# Altium schematic sheet UTHP CAN Connections.SchDoc: Ultimate Truck Hacking Platform
size Letter; Author: Dr. Jeremy Daily; Organization: Systems Cyber Research Group; Address2: Thomas Balzer; Address3: Carson Green; DocumentNumber: Controller Area Networks; Revision: 1; SheetNumber: 2; SheetTotal: 6
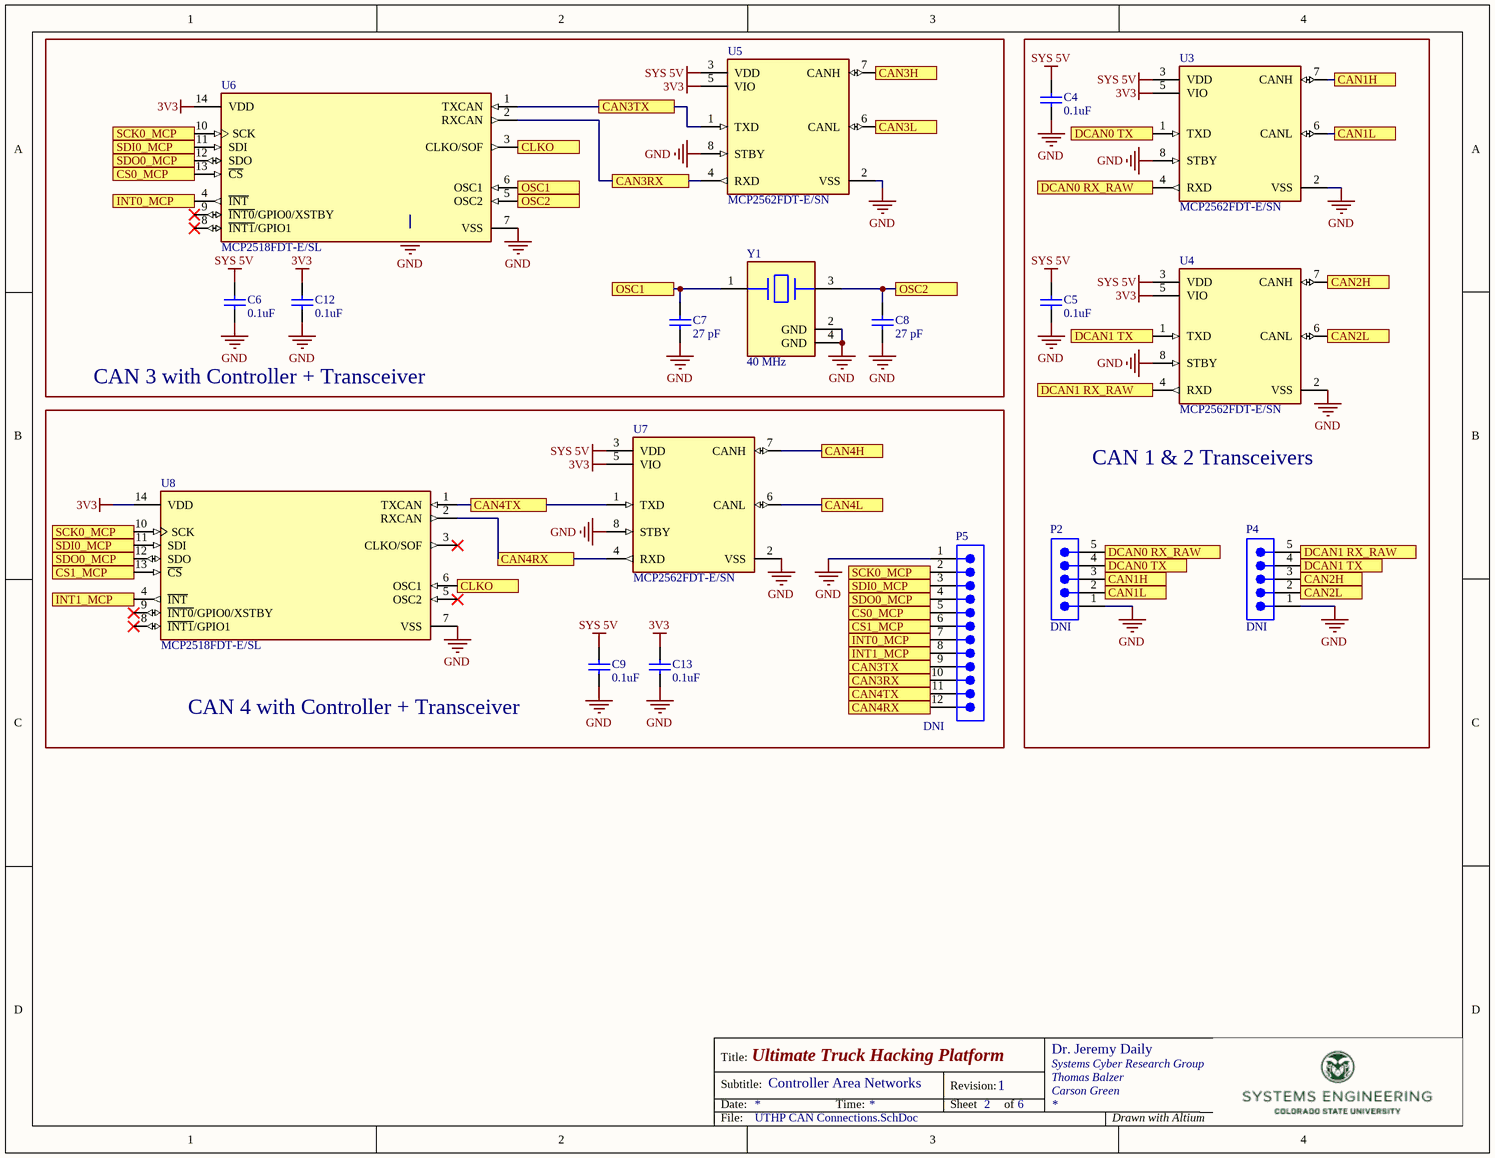
[diagram p0: UTHP CAN Connections.SchDoc]

## Parts
C4  0.1uF  [CAPC1608X90X35LL15T15]
C5  0.1uF  [CAPC1608X90X35LL15T15]
C6  0.1uF  [CAPC1608X90X35LL15T15]
C7  27 pF  [CAPC1005X55X25LL05T10]
C8  27 pF  [CAPC1005X55X25LL05T10]
C9  0.1uF  [CAPC1608X90X35LL15T15]
C12  0.1uF  [CAPC1608X90X35LL15T15]
C13  0.1uF  [CAPC1608X90X35LL15T15]
P2  DNI  [61300511121]
P4  DNI  [61300511121]
P5  DNI  [61301211121]
U3  MCP2562FDT-E/SN  [FP-C04-057-SN-MFG]
U4  MCP2562FDT-E/SN  [FP-C04-057-SN-MFG]
U5  MCP2562FDT-E/SN  [FP-C04-057-SN-MFG]
U6  MCP2518FDT-E/SL  [FP-C04-065-SL-IPC_C]
U7  MCP2562FDT-E/SN  [FP-C04-057-SN-MFG]
U8  MCP2518FDT-E/SL  [FP-C04-065-SL-IPC_C]
Y1  40 MHz  [FP-ABM8G-MFG]

## Blocks framed on the sheet
CAN 3 with Controller + Transceiver: C6-C8 C12 U5 U6 Y1
CAN 1 & 2 Transceivers: C4 C5 P2 P4 U3 U4
CAN 4 with Controller + Transceiver: C9 C13 P5 U7 U8

## Ports
CAN1H, CAN1L, CAN2H, CAN2L, CAN3H, CAN3L, CAN3RX, CAN3TX, CAN4H, CAN4L, CAN4RX, CAN4TX, CLKO, CS0_MCP, CS1_MCP, DCAN0 RX_RAW, DCAN0 TX, DCAN1 RX_RAW, DCAN1 TX, INT0_MCP, INT1_MCP, OSC1, OSC2, SCK0_MCP, SDI0_MCP, SDO0_MCP

## Nets
3V3: C12.1 C13.1 U3.5(VIO) U4.5(VIO) U5.5(VIO) U6.14(VDD) U7.5(VIO) U8.14(VDD)
GND: C4.2 C5.2 C6.2 C7.1 C8.1 C9.2 C12.2 C13.2 P2.1 P4.1 P5.1 U3.2(VSS) U3.8(STBY) U4.2(VSS) U4.8(STBY) U5.2(VSS) U5.8(STBY) U6.7(VSS) U7.2(VSS) U7.8(STBY) U8.7(VSS) Y1.2(GND) Y1.4(GND)
SYS 5V: C4.1 C5.1 C6.1 C9.1 U3.3(VDD) U4.3(VDD) U5.3(VDD) U7.3(VDD)
CAN1H: P2.3 U3.7(CANH) ; port CAN1H
CAN1L: P2.2 U3.6(CANL) ; port CAN1L
CAN2H: P4.3 U4.7(CANH) ; port CAN2H
CAN2L: P4.2 U4.6(CANL) ; port CAN2L
CAN3H: U5.7(CANH) ; port CAN3H
CAN3L: U5.6(CANL) ; port CAN3L
CAN3RX: P5.10 U5.4(RXD) U6.2(RXCAN) ; port CAN3RX
CAN3TX: P5.9 U5.1(TXD) U6.1(TXCAN) ; port CAN3TX
CAN4H: U7.7(CANH) ; port CAN4H
CAN4L: U7.6(CANL) ; port CAN4L
CAN4RX: P5.12 U7.4(RXD) U8.2(RXCAN) ; port CAN4RX
CAN4TX: P5.11 U7.1(TXD) U8.1(TXCAN) ; port CAN4TX
CLKO: U6.3(CLKO/SOF) U8.6(OSC1) ; port CLKO
CS0_MCP: P5.5 U6.13(~{CS}) ; port CS0_MCP
CS1_MCP: P5.6 U8.13(~{CS}) ; port CS1_MCP
DCAN0 RX_RAW: P2.5 U3.4(RXD) ; port DCAN0 RX_RAW
DCAN0 TX: P2.4 U3.1(TXD) ; port DCAN0 TX
DCAN1 RX_RAW: P4.5 U4.4(RXD) ; port DCAN1 RX_RAW
DCAN1 TX: P4.4 U4.1(TXD) ; port DCAN1 TX
INT0_MCP: P5.7 U6.4(~{INT}) ; port INT0_MCP
INT1_MCP: P5.8 U8.4(~{INT}) ; port INT1_MCP
OSC1: C7.2 U6.6(OSC1) Y1.1 ; port OSC1
OSC2: C8.2 U6.5(OSC2) Y1.3 ; port OSC2
SCK0_MCP: P5.2 U6.10(SCK) U8.10(SCK) ; port SCK0_MCP
SDI0_MCP: P5.3 U6.11(SDI) U8.11(SDI) ; port SDI0_MCP
SDO0_MCP: P5.4 U6.12(SDO) U8.12(SDO) ; port SDO0_MCP

Not connected (* = marked no-connect by the designer): U6 8(~{INT1}/GPIO1)* 9(~{INT0}/GPIO0/XSTBY)*; U8 3(CLKO/SOF)* 5(OSC2)* 8(~{INT1}/GPIO1)* 9(~{INT0}/GPIO0/XSTBY)*

## Notes on the sheet
- Title:
- Subtitle:
- Date:
- Time:
- Revision:
- Sheet
- of
- File:
- Drawn with Altium

## Library data of the parts
C4-C6 C9 C12 C13 = CMP-2006-04387-1: 0.1 µF ±10% 50V Ceramic Capacitor X7R 0603 (1608 Metric); Manufacturer: KYOCERA AVX; Part Number: KAM15AR71H104KM; Supplier 1: Digi-Key; Supplier Part Number 1: 478-KAM15AR71H104KMTR-ND; Value: 0.1uF
C7 C8 = CMP-2008-03917-1: 27 pF ±5% 50V Ceramic Capacitor C0G, NP0 0402 (1005 Metric); Part Number: GRM1555C1H270JA01D; Manufacturer: Murata; Value: 27pF; Supplier 1: Digi-Key; Supplier Part Number 1: 490-5869-1-ND
P2 P4 = CMP-1502-01068-2: NexarPartId: 32855526; Operating Supply Voltage: 250V; Number of Contacts: 5; Connector Type: Male Pin; Current Rating: 3A; Contact Resistance: 20mΩ; Pitch: 2.54mm; Gender: Male; Termination: Solder; RoHS: Compliant; Lead Pitch: 2.54mm; Contact Mating Length: 5.9944mm; Number of Positions: 5; Lead Free: Lead Free; Contact Plating: Gold; Number of Pins: 5; Min Operating Temperature: -40°C; Voltage Rating: 250V; Color: Black; Mount: Through Hole; REACH SVHC: Unknown; Packaging: Bulk; Height: 8.89mm; Number of Rows: 1; Orientation: Vertical; Contact Material: Copper; Max Operating Temperature: 105°C
P5 = CMP-1502-01086-2: NexarPartId: 32855538; Gender: Male; Pitch: 2.54mm; Contact Resistance: 20mΩ; Number of Positions: 12; Current Rating: 3A; Connector Type: Male Pin; Operating Supply Voltage: 250V; Contact Material: Copper; Contact Plating: Gold; Color: Black; REACH SVHC: Unknown; Termination: Solder; Number of Contacts: 12; RoHS: Compliant; Lead Pitch: 2.54mm; Orientation: Vertical; Contact Mating Length: 5.9944mm; Mount: Through Hole; Number of Pins: 12; Packaging: Bulk; Number of Rows: 1
U3-U5 U7 = CMP-06279-000005-1: 1/1 Transceiver CANbus 8-SOIC; Manufacturer: Microchip; Value: CAN Transceiver; Part Number: MCP2562FDT-E/SN; Supplier 1: Digi-Key; Supplier Part Number 1: MCP2562FDT-E/SNCT-ND
U6 U8 = CMP-06298-000019-1: IC CAN CONTROLLER SPI 14SOIC; RoHS Compliant: Yes
Y1 = CMP-27762-015223-1: 40 MHz ±20ppm Crystal 18pF 50 Ohms 4-SMD, No Lead; Manufacturer: Abracon LLC; Part Number: ABM8G-40.000MHZ-18-D2Y-T; Value: 40MHz; Supplier 1: Digi-Key; Supplier Part Number 1: 535-10281-1-ND